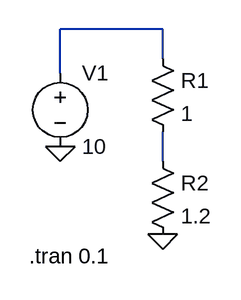
[diagram p0: schematic Draft2.asc]
Draft2.asc, the LTspice schematic file:
Version 4
SHEET 1 880 680
WIRE 368 160 256 160
WIRE 368 192 368 160
WIRE 256 208 256 160
WIRE 368 304 368 272
FLAG 256 288 0
FLAG 368 384 0
SYMBOL voltage 256 192 R0
WINDOW 123 0 0 Left 0
WINDOW 39 0 0 Left 0
SYMATTR InstName V1
SYMATTR Value 10
SYMBOL res 352 176 R0
SYMATTR InstName R1
SYMATTR Value 1
SYMBOL res 352 288 R0
SYMATTR InstName R2
SYMATTR Value 1.2
TEXT 222 408 Left 2 !.tran 0.1

The netlist it stands for:
* Draft2.asc
V1 N001 0 10
R1 N001 N002 1
R2 N002 0 1.2
.tran 0.1
.backanno
.end